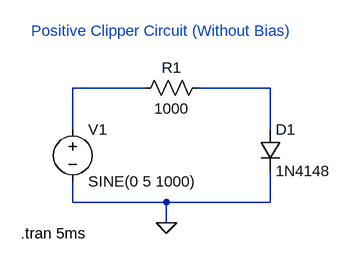
[diagram p0: schematic Assignment 1a (i).asc]
Assignment 1a (i).asc, the LTspice schematic file:
Version 4.1
SHEET 1 880 680
WIRE 176 64 64 64
WIRE 368 64 256 64
WIRE 64 128 64 64
WIRE 368 128 368 64
WIRE 64 240 64 208
WIRE 208 240 64 240
WIRE 368 240 368 192
WIRE 368 240 208 240
WIRE 208 272 208 240
FLAG 208 272 0
SYMBOL voltage 64 112 R0
WINDOW 123 0 0 Left 0
WINDOW 39 0 0 Left 0
SYMATTR InstName V1
SYMATTR Value SINE(0 5 1000)
SYMBOL res 272 48 R90
WINDOW 0 0 56 VBottom 2
WINDOW 3 32 56 VTop 2
SYMATTR InstName R1
SYMATTR Value 1000
SYMBOL diode 352 128 R0
SYMATTR InstName D1
SYMATTR Value 1N4148
TEXT -16 288 Left 2 !.tran 5ms
TEXT 0 -24 Left 2 ;Positive Clipper Circuit (Without Bias)

The netlist it stands for:
* Assignment 1a (i).asc
V1 N001 0 SINE(0 5 1000)
R1 N002 N001 1000
D1 N002 0 1N4148
.model D D
.lib standard.dio
.tran 5ms
* Positive Clipper Circuit (Without Bias)
.backanno
.end